# EAGLE design battery_shield (EAGLE 9.6.2)
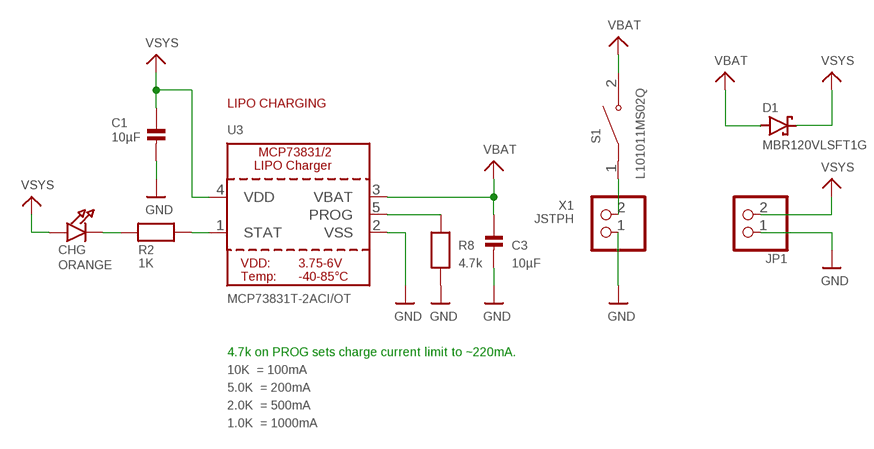
[diagram p0: schematic, sheet 1]

## Parts
C1  10µF  CAP_CERAMIC0805-NOOUTLINE  [0805-NO]
C3  10µF  CAP_CERAMIC0805-NOOUTLINE  [0805-NO]
CHG  ORANGE  LED0805_NOOUTLINE  [CHIPLED_0805_NOOUTLINE]
D1  MBR120VLSFT1G  SMF5.0AT1  [SOD123FL]
JP1  PINHD-1X2  [1X02]
R2  1K  RESISTOR_0603_NOOUT  [0603-NO]
R8  4.7k  RESISTOR_0603_NOOUT  [0603-NO]
S1  L101011MS02Q  [SW_L101011MS02Q]
U3  MCP73831T-2ACI/OT  MCP73831/2  [SOT23-5]
X1  JSTPH  CON_JST_PH_2PIN  [JSTPH2]

## Nets
GND [5V]: C1.2 C3.2 JP1.1 R8.2 U3.2(VSS) X1.1
N$1: CHG.C R2.1
N$2 [5V]: S1.1 X1.2
N$3: R2.2 U3.1(STAT)
N$4: R8.1 U3.5(PROG)
VBAT [5V]: C3.1 D1.A S1.2 U3.3(VBAT)
VSYS [5V]: C1.1 CHG.A D1.C JP1.2 U3.4(VDD)

## Notes on the sheet
- LIPO CHARGING
- 4.7k on PROG sets charge current limit to ~220mA.
- 10K  = 100mA
- 5.0K  = 200mA
- 2.0K  = 500mA
- 1.0K  = 1000mA

## Library data of the parts
C1 C3 = microbuilder:CAP_CERAMIC: Ceramic Capacitors For new designs, use the packages preceded by an '_' character since they are more reliable: The following footprints should be used on most boards: _0402 - Standard footprint for regular board layouts _0603 - Standard footprint for regular board layouts _0805 - Standard footprint for regular board layouts _1206 - Standard footprint for regular board layouts For extremely tight-pitch boards where space is at a premium, the following 'micro-pitch' footprints can be used (smaller pads, no silkscreen outline, etc.): _0402MP - Micro-pitch footprint for very dense/compact boards _0603MP - Micro-pitch footprint for very dense/compact boards _0805MP - Micro-pitch footprint for very dense/compact boards _1206MP - Micro-pitch footprint for very dense/compact boards
CHG = microbuilder:LED: LED 0603 - 0603 Surface Mount Package 2mA: Green LED - Low Power (3.9mcd, 2ma, 1.7Vf) - Digikey: 475-2709-2-ND Orange LED - Low Power (9.8mcd, 2ma, 1.8Vf) - Digikey: 475-1194-2-ND Red LED - Low Power (5mcd, 2ma, 1.8Vf) - Digikey: 475-1195-2-ND Yellow LED - Low Power (7mcd, 2ma, 1.8Vf) - Digikey: 475-1196-2-ND 5mA: Blue LED - Low Power (17mcd, 5ma, 2.9Vf) - Digikey: LNJ937W8CRACT-ND 0805 - 0805 Surface Mount Package 2mA: Red LED (8.8mcd, 2mA, 1.8Vf, Clear) - Low Power [Digikey: 475-2510-1-ND] Green LED (5mcd, 2mA, 1.8Vf, Clear) - Low Power [Digikey: 475-2730-1-ND] Yellow LED (11.3mcd, 2mA, 1.8Vf, Clear) - Low Power [Digikey: 475-2555-1-ND] 20mA: Red LED (104mcd, 20mA, Diffused) - LS R976 [Digikey: 475-1278-6-ND] Red LED (12mcd, 20mA, 2.0Vf, Clear) - APT2012EC [Digikey: 754-1128-1-ND] Green LED (15mcd, 20mA, 2.2Vf, Clear) - APT2012GC [Digikey: 754-1131-1-ND] Orange LED (160mcd, 20mA, 2.1Vf, Clear) - APT2012SECK [Digikey: 754-1130-1-ND] 1206 - 1206 Surface Mount Package Green LED (26mcd, 20mA, Diffused) - LG N971 [Digikey: 475-1407-6-ND] Red LED (15mcd, 20mA, Diffused) - LH N974 [Digikey: 475-1416-6-ND] Cree - Cree High-Power Surface Mount LEDs XPEBWT-L1-0000-00D50 - White 111lm 350mA 2.9Vf 6200K 110° XTEAWT-00-0000-00000LEE3 - White 114lm 350mA 2.85Vf 5000K 115° Everlight - Everlight 45-21 Series Surface Mount LEDs 45-21/QK2C-B2832AC2CB2/2T - Warm White 2000mcd 20mA 3.25Vf 3050K 120° 45-21/LK2C-B38452C4CB2/2T - Nuetral White 2000mcd 20mA 3.25Vf 4150K 120° 45-21/LK2C-B50634C6CB2/2T - Cold White 2200mcd 20mA 3.25Vf 5650K 120° PLCC2 Reverse Mount LS T77K-J1L2-1-0-2-R18-Z - Red 11.25mcd 2mA 1.8Vf 630nm 120° LO T77K-L1M2-24-Z - Orange 19.6mcd 2mA 1.8Vf 606nm 120° LY T77K-K2M1-26-Z - Yellow 15.7mcd 2mA 1.8Vf 587nm 120°
D1 = diode:SMF5.0AT1: 200 W Transient Voltage Suppressor Source: Data sheet <http://www.onsemi.com/pub_link/Collateral/SMF5.0AT1-D.PDF>
JP1 = pinhead2:PINHD-1X2: PIN HEADER
R2 R8 = microbuilder:RESISTOR: Resistors For new designs, use the packages preceded by an '_' character since they are more reliable: The following footprints should be used on most boards: _0402 - Standard footprint for regular board layouts _0603 - Standard footprint for regular board layouts _0805 - Standard footprint for regular board layouts _1206 - Standard footprint for regular board layouts For extremely tight-pitch boards where space is at a premium, the following 'micro-pitch' footprints can be used (smaller pads, no silkscreen outline, etc.): _0402MP - Micro-pitch footprint for very dense/compact boards _0603MP - Micro-pitch footprint for very dense/compact boards _0805MP - Micro-pitch footprint for very dense/compact boards _1206MP - Micro-pitch footprint for very dense/compact boards
S1 = L101011MS02Q:L101011MS02Q: Switch Slide SPST Top Slide 4A 250VAC 125VDC PC Pins Thru-Hole Check prices <https://pricing.snapeda.com/parts/L101011MS02Q/C%26K/view-part?ref=eda>; AVAILABILITY: In Stock; DESCRIPTION: Slide Switch SPST Through Hole; MF: C&K; MP: L101011MS02Q; PACKAGE: None; PRICE: None; PURCHASE-URL: https://pricing.snapeda.com/search/part/L101011MS02Q/?ref=eda
U3 = microbuilder:MCP73831/2: MCP73831/2 LIPO Charger VDD: 3.75 - 6V Temp -40 - 85°C Programmable Charge Rate: 15-500mA NOTE: STAT is a tri-state logic output on the MCP73831 and an open-drain output on the MCP73832. SOT23-5 with 4.2V output and tri-state logic on STAT = MCP73831T-2ACI/OT
X1 = microbuilder:CON_JST_PH_2PIN: JST 2-Pin Right-Angle Connector PH-Series - 4UConnector: 17311 SH-Series - 4UConnector: 07278

## Net classes
0 default: width 0.5 mm
1 5V: width 0.75 mm

## Board
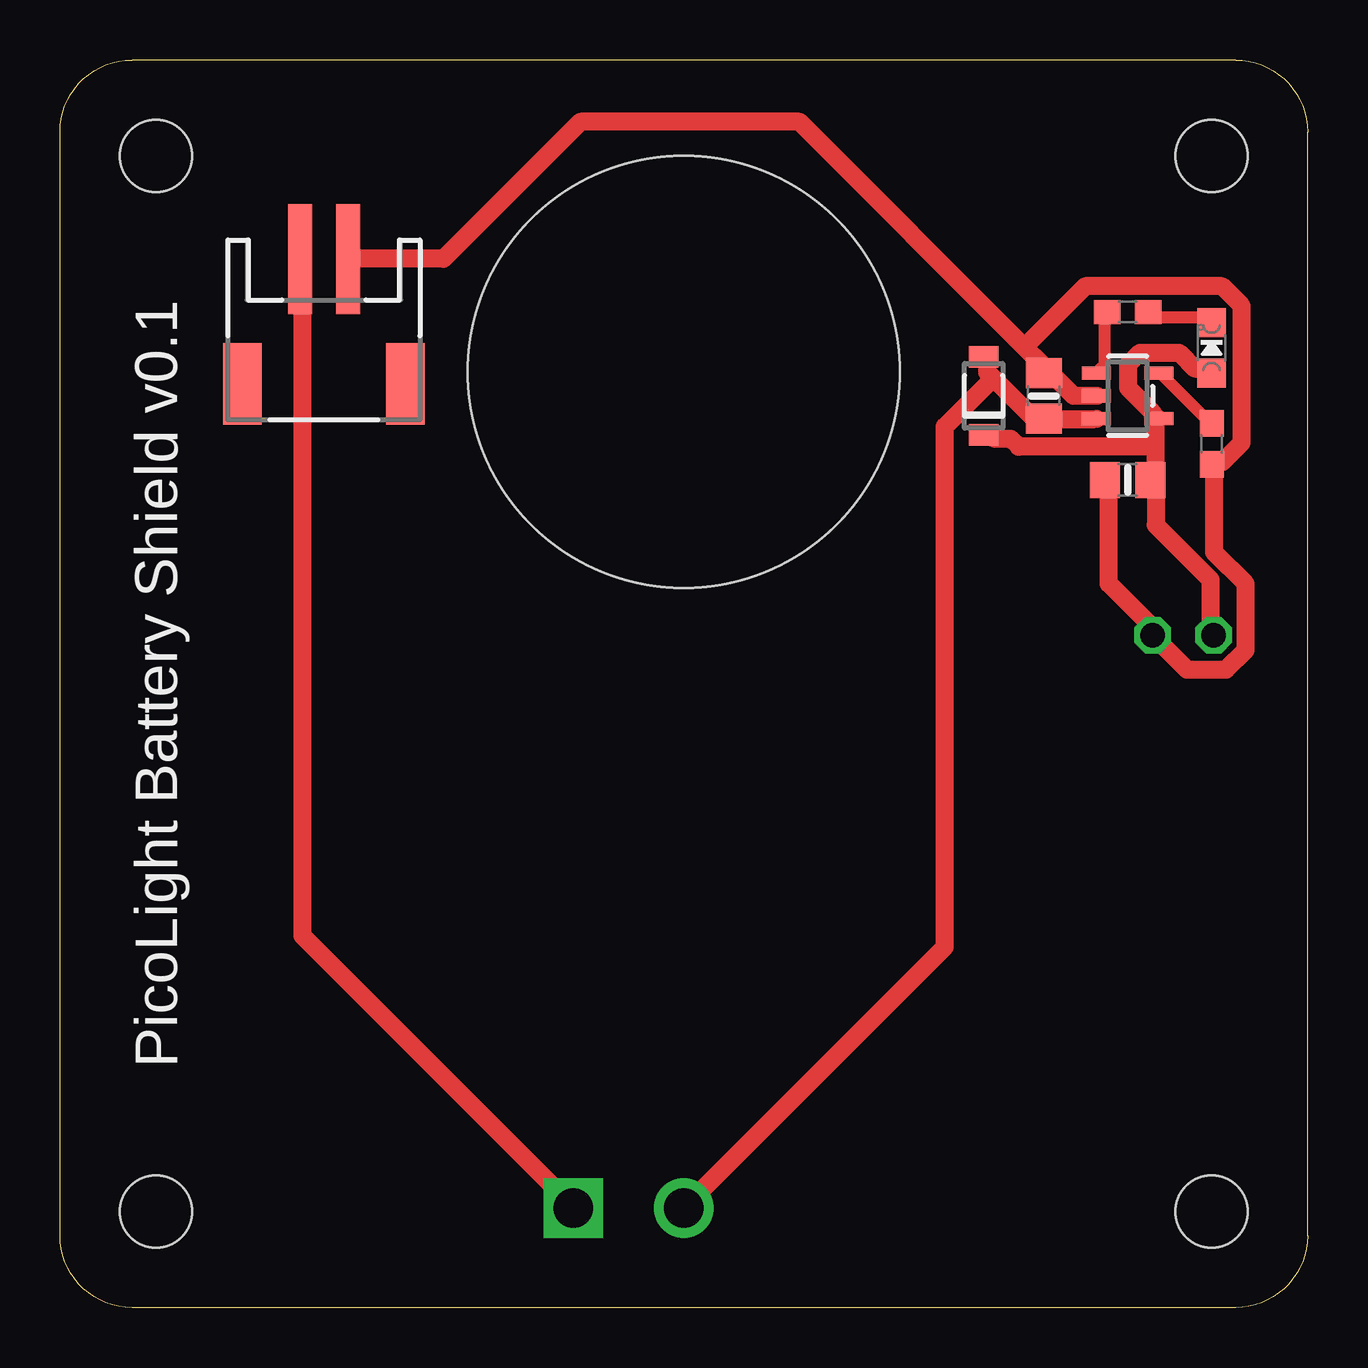
[diagram p1: board, top side]
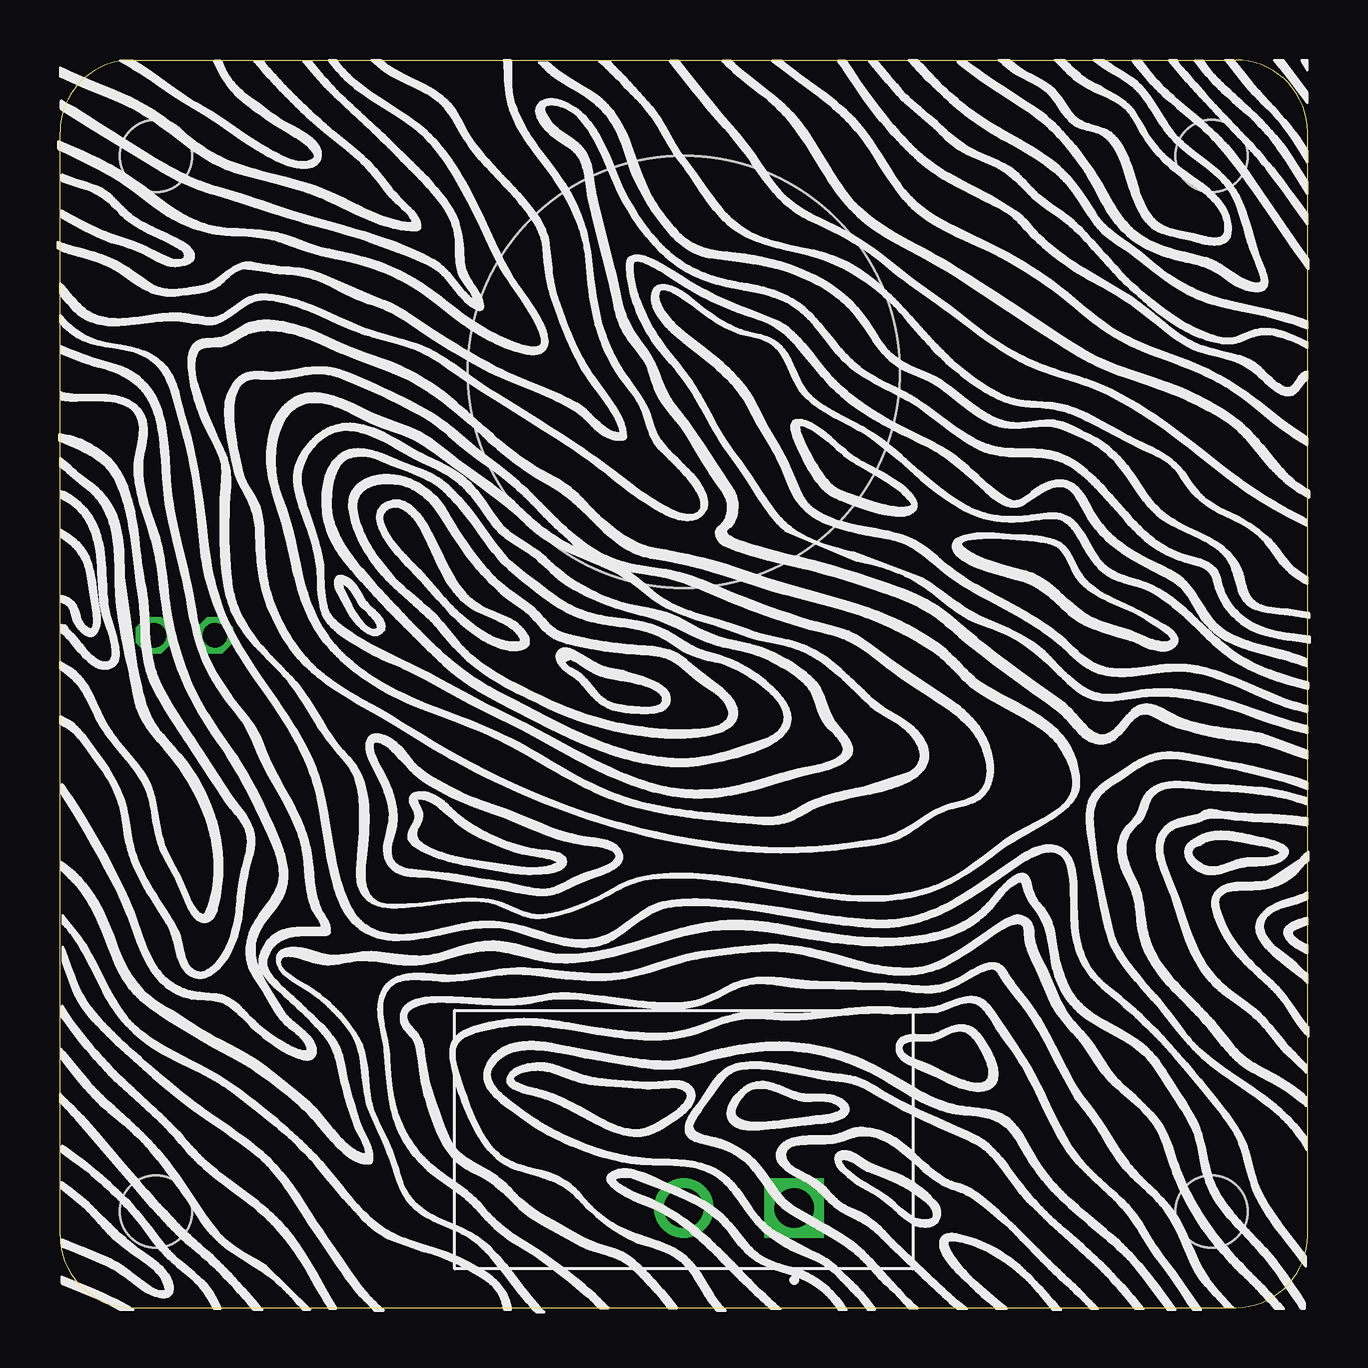
[diagram p2: board, bottom side, seen from below]

Size 52 x 52 mm. Coordinates in mm from the lower left corner, seen from the top.
Outline: 49,0 3,0 arc-90 0,3 0,49 arc-90 3,52 49,52 arc-90 52,49 52,3 arc-90 49,0
Copper layers (1*16): Top 0.035mm / dielectric 1.5mm / Bottom 0.035mm
Design rules "default": minimum track width 6mil, minimum drill 0.35mm, track to track 6mil, track to pad 6mil, pad to pad 6mil, via to via 6mil, smd to smd 6mil, copper to edge 40mil, drill to drill 6mil, minimum pad ring 10mil, minimum via ring 8mil, stop-mask expansion 4mil, vias tented up to drill 0mil, thermal gap 10mil
Holes 3 mm at 4,4 4,48 48,48 48,4
Holes 18 mm at 26,39
bRestrict: area 1.5,45.5 to 6.5,50.5; area 45.5,45.5 to 50.5,50.5; area 45.5,1.5 to 50.5,6.5; area 1.5,1.5 to 6.5,6.5

### Footprints (pad centres in the part's own frame; a part is rotated, then mirrored left to right if it is on the bottom)
0805-NO = smd 1.24 x 1.5: 1 -0.95,0; 2 0.95,0
CHIPLED_0805_NOOUTLINE = smd 1.2 x 1.2: A 0,-1.05; C 0,1.05
SOD123FL = smd 0.91 x 1.22: A 1.625,0; C -1.625,0
1X02 = drill 1.016 octagon: 1 -1.27,0; 2 1.27,0
0603-NO = smd 1.1 x 1: 1 -0.85,0; 2 0.85,0
SW_L101011MS02Q = drill 1.65 pad 2.48 square: 1 -4.6,2.85 | drill 1.65 pad 2.48: 2 0,2.85
SOT23-5 = smd 0.55 x 1.2: 1 -0.95,-1.3; 2 0,-1.3; 3 0.95,-1.3; 4 0.95,1.3; 5 -0.95,1.3
JSTPH2 = smd 1 x 4.6: 1 -1,-3.7; 2 1,-3.7 | smd 1.6 x 3.4: NC1 -3.4,1.5; NC2 3.4,1.5

### Placement (x,y rotation side)
C1  44.5,34.5 180 top
C3  41,38 90 top
CHG  48,40 0 top
D1  38.5,38 90 top
JP1  46.82,28.03 0 top
R2  44.5,41.5 180 top
R8  48,36 270 top
S1  26,7 180 bottom
U3  44.5,38 270 top
X1  11,40 180 top

### Tracks (layer width: path | path; a pad name or v marks a point on that pad's centre or on a via)
GND
  Top 0.75: 40.2,40.04 40.94,39.31 C3.2 41.1,38.82 41.43,38.82 42.24,38 43.22,38 U3.2 | 40.2,40.04 30.83,49.42 21.69,49.42 15.98,43.71 12.07,43.71 X1.1 | 40.2,40.04 42.73,42.57 48.44,42.57 49.26,41.75 49.26,36.05 48.44,35.23 R8.2 48.11,35.07 48.11,31.48 49.42,30.17 49.42,27.4 48.6,26.59 46.97,26.59 45.67,27.89 JP1.1 45.51,28.38 43.71,30.17 43.71,34.41 C1.2
N$1
  Top 0.5: R2.1 45.67,41.26 47.79,41.26 47.95,41.1 CHG.C
N$2
  Top 0.75: X1.2 10.11,43.55 10.11,15.49 21.37,4.24 S1.1
N$3
  Top 0.5: R2.2 43.55,41.43 43.55,39.31 43.38,39.14 U3.1
N$4
  Top 0.5: R8.1 47.95,36.86 45.83,38.98 U3.5
VBAT
  Top 0.75: U3.3 43.06,37.02 41.1,37.02 C3.1 40.61,37.02 38.9,38.74 | 38.9,38.74 38.66,38.98 38.66,39.47 D1.A | 38.9,38.74 36.88,36.72 36.88,15.03 26.1,4.24 S1.2
VSYS
  Top 0.75: 45.67,35.88 45.67,34.74 45.51,34.58 C1.1 45.67,34.25 45.67,32.62 47.95,30.34 47.95,28.05 JP1.2 | 45.67,35.88 45.67,37.02 | 45.67,37.02 U3.4 | CHG.A 47.62,39.14 47.3,39.14 46.65,39.8 45.02,39.8 44.53,39.31 44.53,38.33 45.51,37.35 45.67,37.02 | 45.67,35.88 39.96,35.88 39.63,36.21 38.98,36.21 D1.C

### Text on the board
tPlace: PicoLight Battery Shield v0.1